# Altium schematic sheet I2C_Keypad.SchDoc: STM32F446 CNC
size B; Author: AM; CompanyName: Expatria Technologies; DrawnBy: A.Marles; Engineer: AM; Organization: Expatria Technolgoies; DocumentNumber: 12; SheetNumber: 12; SheetTotal: 14
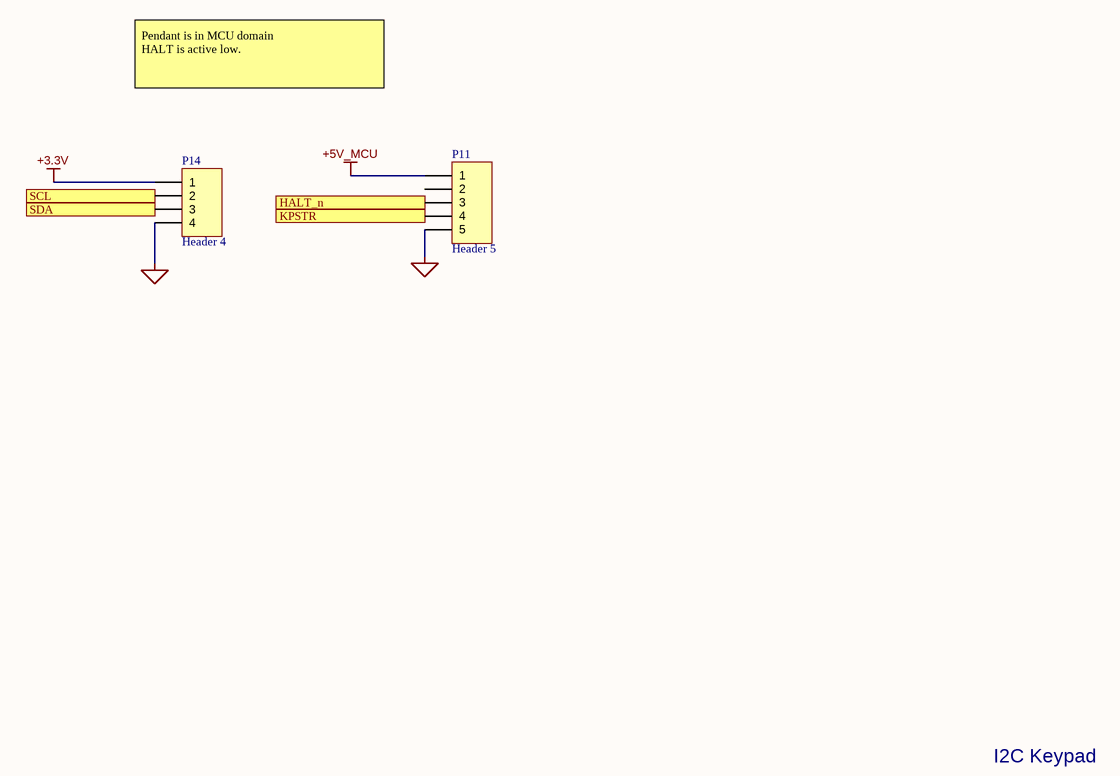
[diagram p0: I2C_Keypad.SchDoc]

## Parts
P11  Header 5  [HDR1X5]
P14  Header 4  [HDR1X4]

## Ports
HALT_n (out), KPSTR (out), SCL (in), SDA (in)

## Nets
+3.3V: P14.1
+5V_MCU: P11.1
MCU_GND: P11.5 P14.4
HALT_n: P11.3 ; port HALT_n
KPSTR: P11.4 ; port KPSTR
SCL: P14.2 ; port SCL
SDA: P14.3 ; port SDA

Not connected (* = marked no-connect by the designer): P11 2

## Notes on the sheet
- Pendant is in MCU domain
  HALT is active low.
- I2C Keypad
- SHEET
- Expatria Technologies
- 1136 Glade Court
- Port Coquitlam, BC V3B 1R5
- PROJECT
- SIZE
- ENGR
- MODIFIED
- DOCUMENT
- REV
- Copyright Expatria Technologies 2022. This document describes Open Hardware and is licensed under the CERN-OHL-S v2. No warranty is implied or expressed.
- EMAIL: INFO@EXPATRIA.CA
- B
- /

## Library data of the parts
P11 = Header 5: Header, 5-Pin; LatestRevisionDate: 17-Jul-2002; LatestRevisionNote: Re-released for DXP Platform.; Publisher: Altium Limited; SuppliersPartNumber: C124379
P14 = Header 4: Header, 4-Pin; Publisher: Altium Limited; SuppliersPartNumber: C2691448